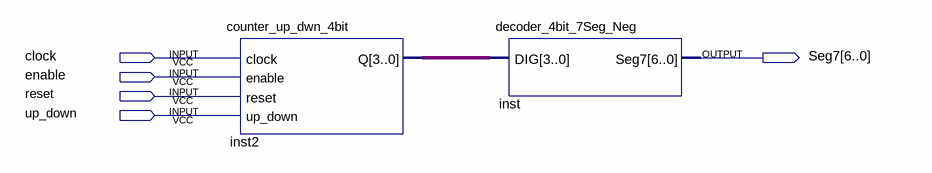
[diagram p0: schematic sheet]
// Quartus schematic counter_decoder_7Seg_4bit.bdf as structural Verilog: 2 symbols, 5 pins
module counter_decoder_7Seg_4bit (
  input  clock,
  input  enable,
  input  reset,
  input  up_down,
  output [6:0] Seg7
);

  wire [3:0] inst2_q;

  counter_up_dwn_4bit inst2 (.clock(clock), .enable(enable), .reset(reset), .up_down(up_down), .Q(inst2_q));
  decoder_4bit_7Seg_Neg inst (.DIG(inst2_q), .Seg7(Seg7));
endmodule
